# EAGLE schematic 8stepsv2 (EAGLE 7.4.0)
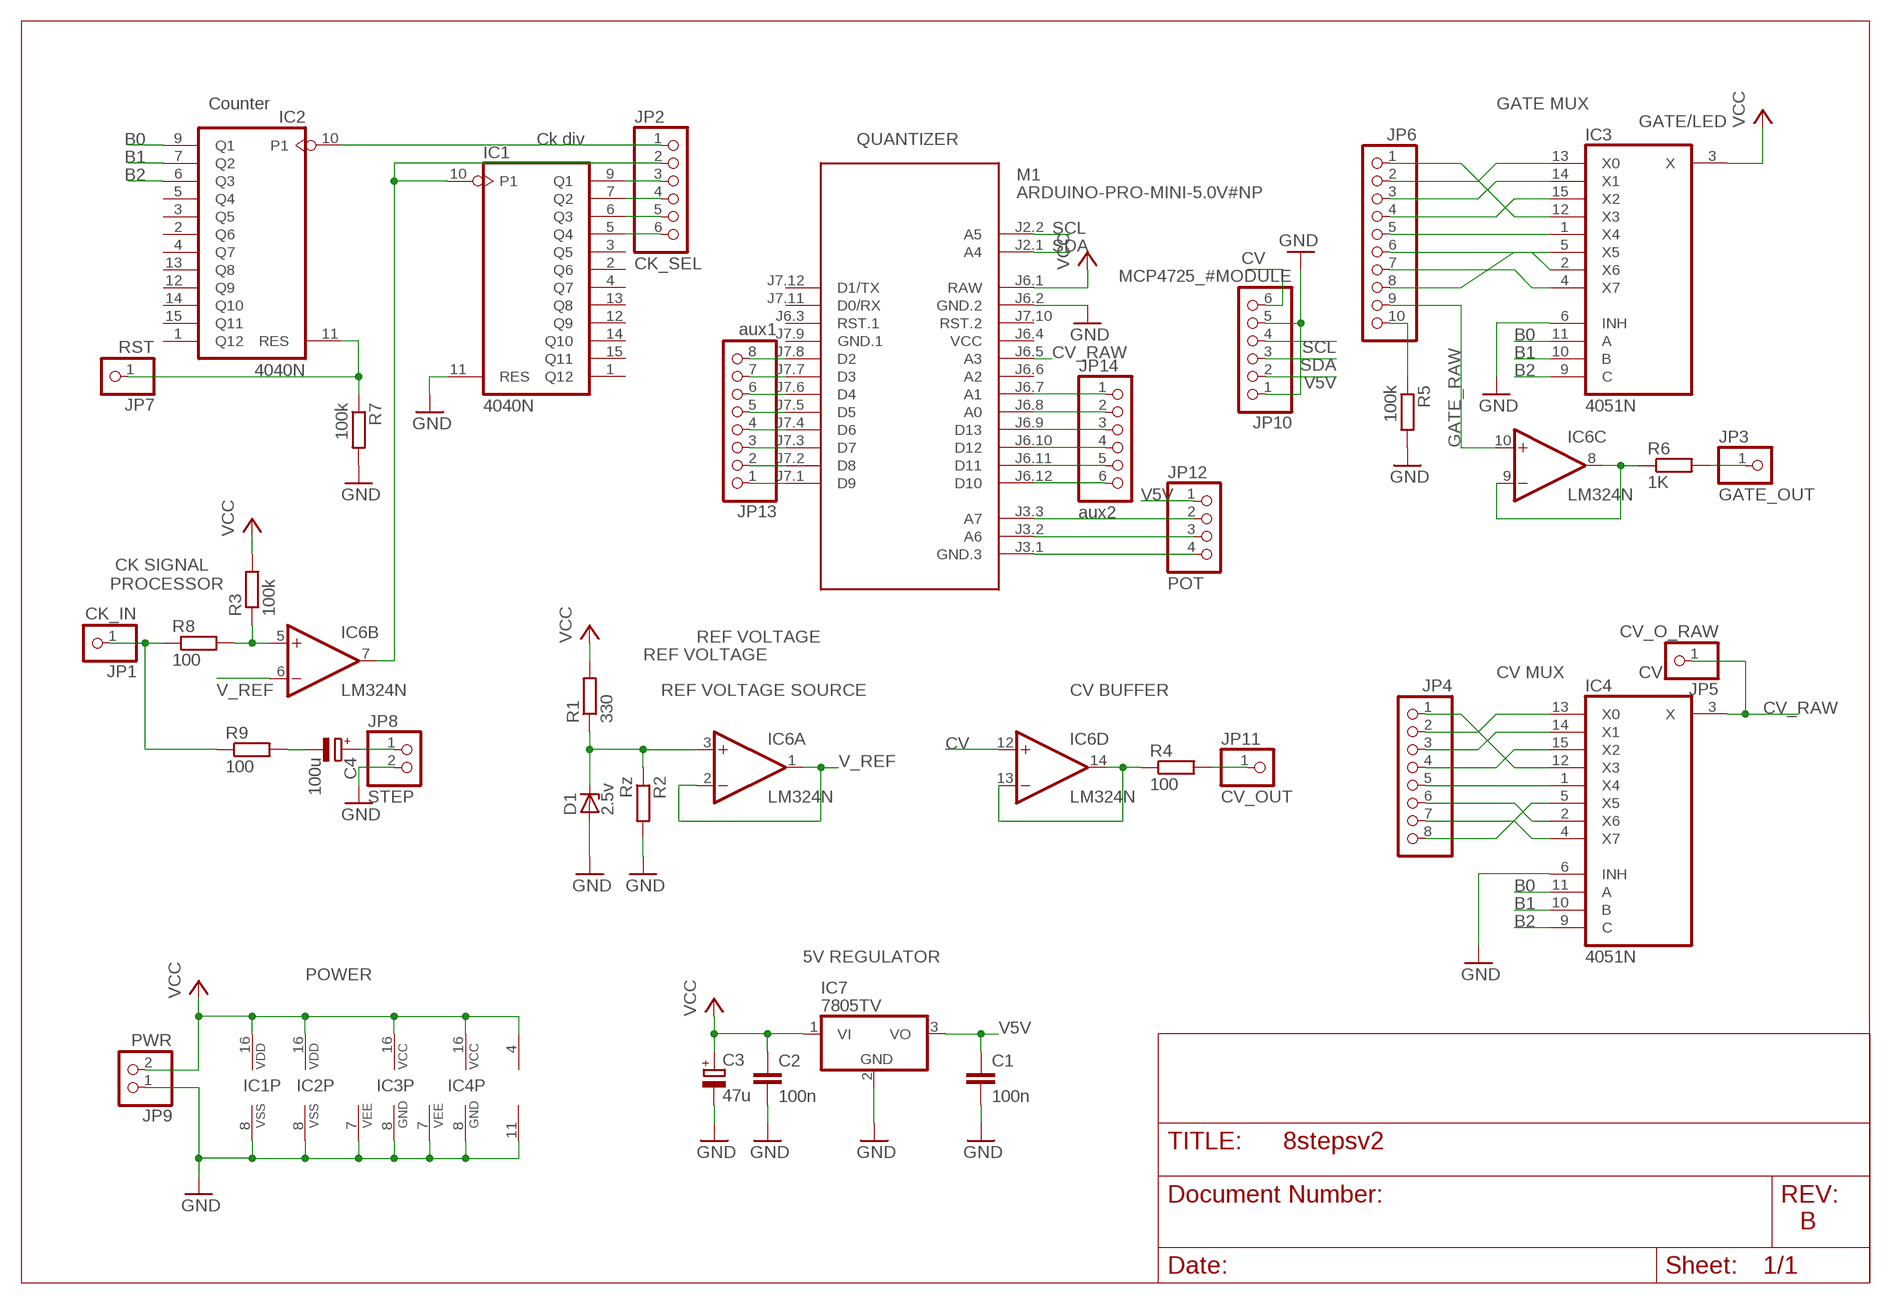
[diagram p0: schematic, sheet 1]

## Parts
C1  100n  C-EU050-025X075  [C050-025X075]
C2  100n  C-EU050-025X075  [C050-025X075]
C3  47u  CPOL-EUE2.5-7  [E2,5-7]
C4  100u  CPOL-EUE2.5-7  [E2,5-7]
D1  2.5v  ZENER-DIODEZD-2.5  [ZDIO-2.5]
IC1  4040N  [DIL16]
IC2  4040N  [DIL16]
IC3  4051N  [DIL16]
IC4  4051N  [DIL16]
IC6  LM324N  [DIL14]
IC7  7805TV  [TO220V]
JP1  CK_IN  PINHD-1X1  [1X01]
JP2  CK_SEL  PINHD-1X6  [1X06]
JP3  GATE_OUT  PINHD-1X1  [1X01]
JP4  PINHD-1X8  [1X08]
JP5  CV_O_RAW  PINHD-1X1  [1X01]
JP6  PINHD-1X10  [1X10]
JP7  RST  PINHD-1X1  [1X01]
JP8  STEP  PINHD-1X2  [1X02]
JP9  PWR  PINHD-1X2  [1X02]
JP10  MCP4725_#MODULE  PINHD-1X6  [1X06]
JP11  CV_OUT  PINHD-1X1  [1X01]
JP12  POT  PINHD-1X4  [1X04]
JP13  aux1  PINHD-1X8  [1X08]
JP14  aux2  PINHD-1X6  [1X06]
M1  ARDUINO-PRO-MINI-5.0V#NP  [ARDUINO-PRO-MINI#NP]
R1  330  R-EU_0207/2V  [0207/2V]
R2  Rz  R-EU_0207/2V  [0207/2V]
R3  100k  R-EU_0207/2V  [0207/2V]
R4  100  R-EU_0207/2V  [0207/2V]
R5  100k  R-EU_0207/2V  [0207/2V]
R6  1K  R-EU_0207/2V  [0207/2V]
R7  100k  R-EU_0207/2V  [0207/2V]
R8  100  R-EU_0207/2V  [0207/2V]
R9  100  R-EU_0207/2V  [0207/2V]

## Nets
B0: IC2.9(Q1) IC3.11(A) IC4.11(A)
B1: IC2.7(Q2) IC3.10(B) IC4.10(B)
B2: IC2.6(Q3) IC3.9(C) IC4.9(C)
CV: IC6.12(D:+IN) JP10.6
CV_RAW: IC4.3(X) JP5.1 M1.J6.5(A3)
GATE_RAW: IC6.10(C:+IN) JP6.9
GND: C1.2 C2.2 C3.- D1.A IC1.8(VSS) IC1.11(RES) IC2.8(VSS) IC3.6(INH) IC3.7(VEE) IC3.8(GND) IC4.6(INH) IC4.7(VEE) IC4.8(GND) IC6.11(P:V-) IC7.2(GND) JP8.2 JP9.1 JP10.1 JP10.5 JP12.4 M1.J3.1(GND.3) M1.J6.2(GND.2) R2.2 R5.2 R7.2
N$1: D1.C IC6.3(A:+IN) R1.1 R2.1
N$2: JP1.1 R8.1 R9.1
N$3: JP13.1 M1.J7.1(D9)
N$4: IC1.10(P1) IC6.7(B:OUT) JP2.2
N$5: IC1.9(Q1) JP2.3
N$6: IC1.7(Q2) JP2.4
N$7: IC1.6(Q3) JP2.5
N$8: IC1.5(Q4) JP2.6
N$9: IC2.10(P1) JP2.1
N$10: IC3.12(X3) JP6.1
N$11: IC3.13(X0) JP6.2
N$12: IC3.14(X1) JP6.3
N$13: IC3.15(X2) JP6.4
N$14: IC3.2(X6) JP6.6
N$15: IC3.5(X5) JP6.8
N$16: IC3.4(X7) JP6.7
N$17: IC3.1(X4) JP6.5
N$18: IC4.12(X3) JP4.1
N$19: IC4.13(X0) JP4.2
N$20: IC4.14(X1) JP4.3
N$21: IC4.15(X2) JP4.4
N$22: IC4.1(X4) JP4.5
N$23: IC4.2(X6) JP4.6
N$24: IC4.4(X7) JP4.7
N$25: IC4.5(X5) JP4.8
N$26: IC6.13(D:-IN) IC6.14(D:OUT) R4.1
N$27: JP11.1 R4.2
N$28: JP6.10 R5.1
N$29: IC2.11(RES) JP7.1 R7.1
N$30: IC6.8(C:OUT) IC6.9(C:-IN) R6.1
N$31: JP3.1 R6.2
N$32: C4.- R9.2
N$33: IC6.5(B:+IN) R3.1 R8.2
N$34: C4.+ JP8.1
N$35: JP12.3 M1.J3.2(A6)
N$36: JP12.2 M1.J3.3(A7)
N$37: JP13.2 M1.J7.2(D8)
N$38: JP13.3 M1.J7.3(D7)
N$39: JP13.4 M1.J7.4(D6)
N$40: JP13.5 M1.J7.5(D5)
N$41: JP13.6 M1.J7.6(D4)
N$42: JP13.7 M1.J7.7(D3)
N$43: JP13.8 M1.J7.8(D2)
N$45: JP14.1 M1.J6.7(A1)
N$46: JP14.2 M1.J6.8(A0)
N$47: JP14.3 M1.J6.9(D13)
N$48: JP14.4 M1.J6.10(D12)
N$49: JP14.5 M1.J6.11(D11)
N$50: JP14.6 M1.J6.12(D10)
SCL: JP10.4 M1.J2.2(A5)
SDA: JP10.3 M1.J2.1(A4)
V5V: C1.1 IC7.3(VO) JP10.2 JP12.1
V_REF: IC6.1(A:OUT) IC6.2(A:-IN) IC6.6(B:-IN)
VCC: C2.1 C3.+ IC1.16(VDD) IC2.16(VDD) IC3.3(X) IC3.16(VCC) IC4.16(VCC) IC6.4(P:V+) IC7.1(VI) JP9.2 M1.J6.1(RAW) R1.2 R3.2
Unconnected: IC1.1(Q12) IC1.2(Q6) IC1.3(Q5) IC1.4(Q7) IC1.12(Q9) IC1.13(Q8) IC1.14(Q10) IC1.15(Q11) IC2.1(Q12) IC2.2(Q6) IC2.3(Q5) IC2.4(Q7) IC2.5(Q4) IC2.12(Q9) IC2.13(Q8) IC2.14(Q10) IC2.15(Q11) M1.J6.3(RST.1) M1.J6.6(A2) M1.J7.10(RST.2) M1.J7.11(D0/RX) M1.J7.12(D1/TX)

## Notes on the sheet
- Counter | GATE MUX
- GATE/LED
- Ck div | QUANTIZER
- CK SIGNAL
  PROCESSOR
- REF VOLTAGE
- REF VOLTAGE
- CV MUX | CV
- REF VOLTAGE SOURCE | CV BUFFER
- 5V REGULATOR
- POWER
- B

## Power pins joined to a net without a drawn wire
GND.1: M1.J7.9(GND.1)
VCC: M1.J6.4(VCC)

## Library data of the parts
C1 C2 = rcl:C-EU: CAPACITOR, European symbol
C3 C4 = rcl:CPOL-EU: POLARIZED CAPACITOR, European symbol
D1 = diode:ZENER-DIODE: Z-Diode
IC1 IC2 = 40xx:4040: 12-stage binary/ripple COUNTER
IC3 IC4 = 40xx:4051: 8-channel ANALOG MULTIPLEXER
IC6 = linear:LM324: OP AMP
IC7 = linear:78*: Positive VOLTAGE REGULATOR Source: http://cache.national.com/ds/LM/LM78L05.pdf http://www.fairchildsemi.com/ds/LM/LM7805.pdf
JP1 JP3 JP5 JP7 JP11 = pinhead:PINHD-1X1: PIN HEADER
JP2 JP10 JP14 = pinhead:PINHD-1X6: PIN HEADER
JP4 JP13 = pinhead:PINHD-1X8: PIN HEADER
JP6 = pinhead:PINHD-1X10: PIN HEADER
JP8 JP9 = pinhead:PINHD-1X2: PIN HEADER
JP12 = pinhead:PINHD-1X4: PIN HEADER
M1 = diy-modules:ARDUINO-PRO-MINI-*#NP: Arduino Pro Mini (and compatible devices) without programming pads More details available here: https://www.arduino.cc/en/Main/ArduinoBoardProMini Click here to find device on ebay.com <http://www.ebay.com/sch/arduino+pro+mini>
R1-R9 = rcl:R-EU_: RESISTOR, European symbol